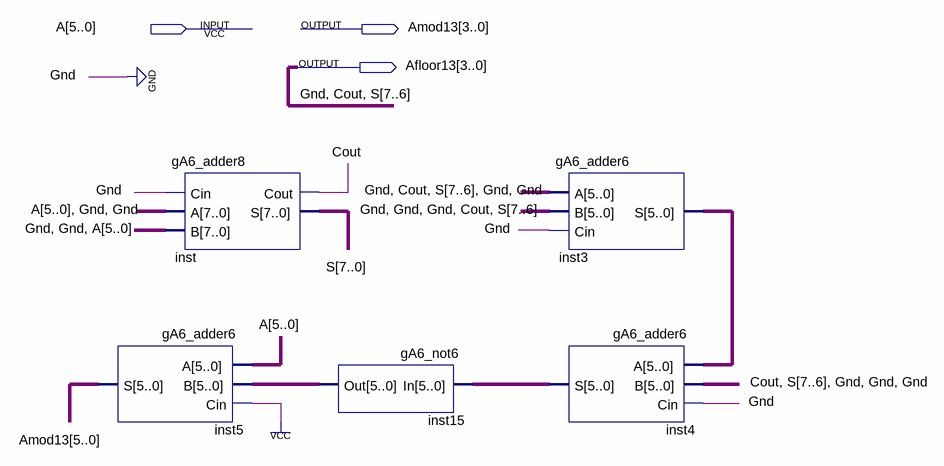
[diagram p0: schematic sheet]
// Quartus schematic gA6_modulo_13.bdf as structural Verilog: 5 symbols, 3 pins
module gA6_modulo_13 (
  input  [5:0] A,
  output [5:0] Amod13,
  output [3:0] Afloor13
);

  wire [5:0] inst3_s, inst4_s, inst15_out, S;

  gA6_adder6 inst5 (.A(A), .B(inst15_out), .Cin(1'b1), .S(Amod13));
  gA6_adder8 inst (.A({A, 2'b00}), .B({2'b00, A}), .Cin(1'b0), .Cout(Afloor13[2]), .S({Afloor13[1:0], S}));
  gA6_not6 inst15 (.In(inst4_s), .Out(inst15_out));
  gA6_adder6 inst3 (.A({1'b0, Afloor13[2:0], 2'b00}), .B({3'b000, Afloor13[2:0]}), .Cin(1'b0), .S(inst3_s));
  gA6_adder6 inst4 (.A(inst3_s), .B({Afloor13[2:0], 3'b000}), .Cin(1'b0), .S(inst4_s));

  assign Afloor13[3] = 1'b0;

  // Other names for the same wires on the sheet: S[7:6] = Afloor13[1:0]; Cout = Afloor13[2]
endmodule
